# EAGLE design XBee SX THT Adapter (EAGLE 7.5.0)
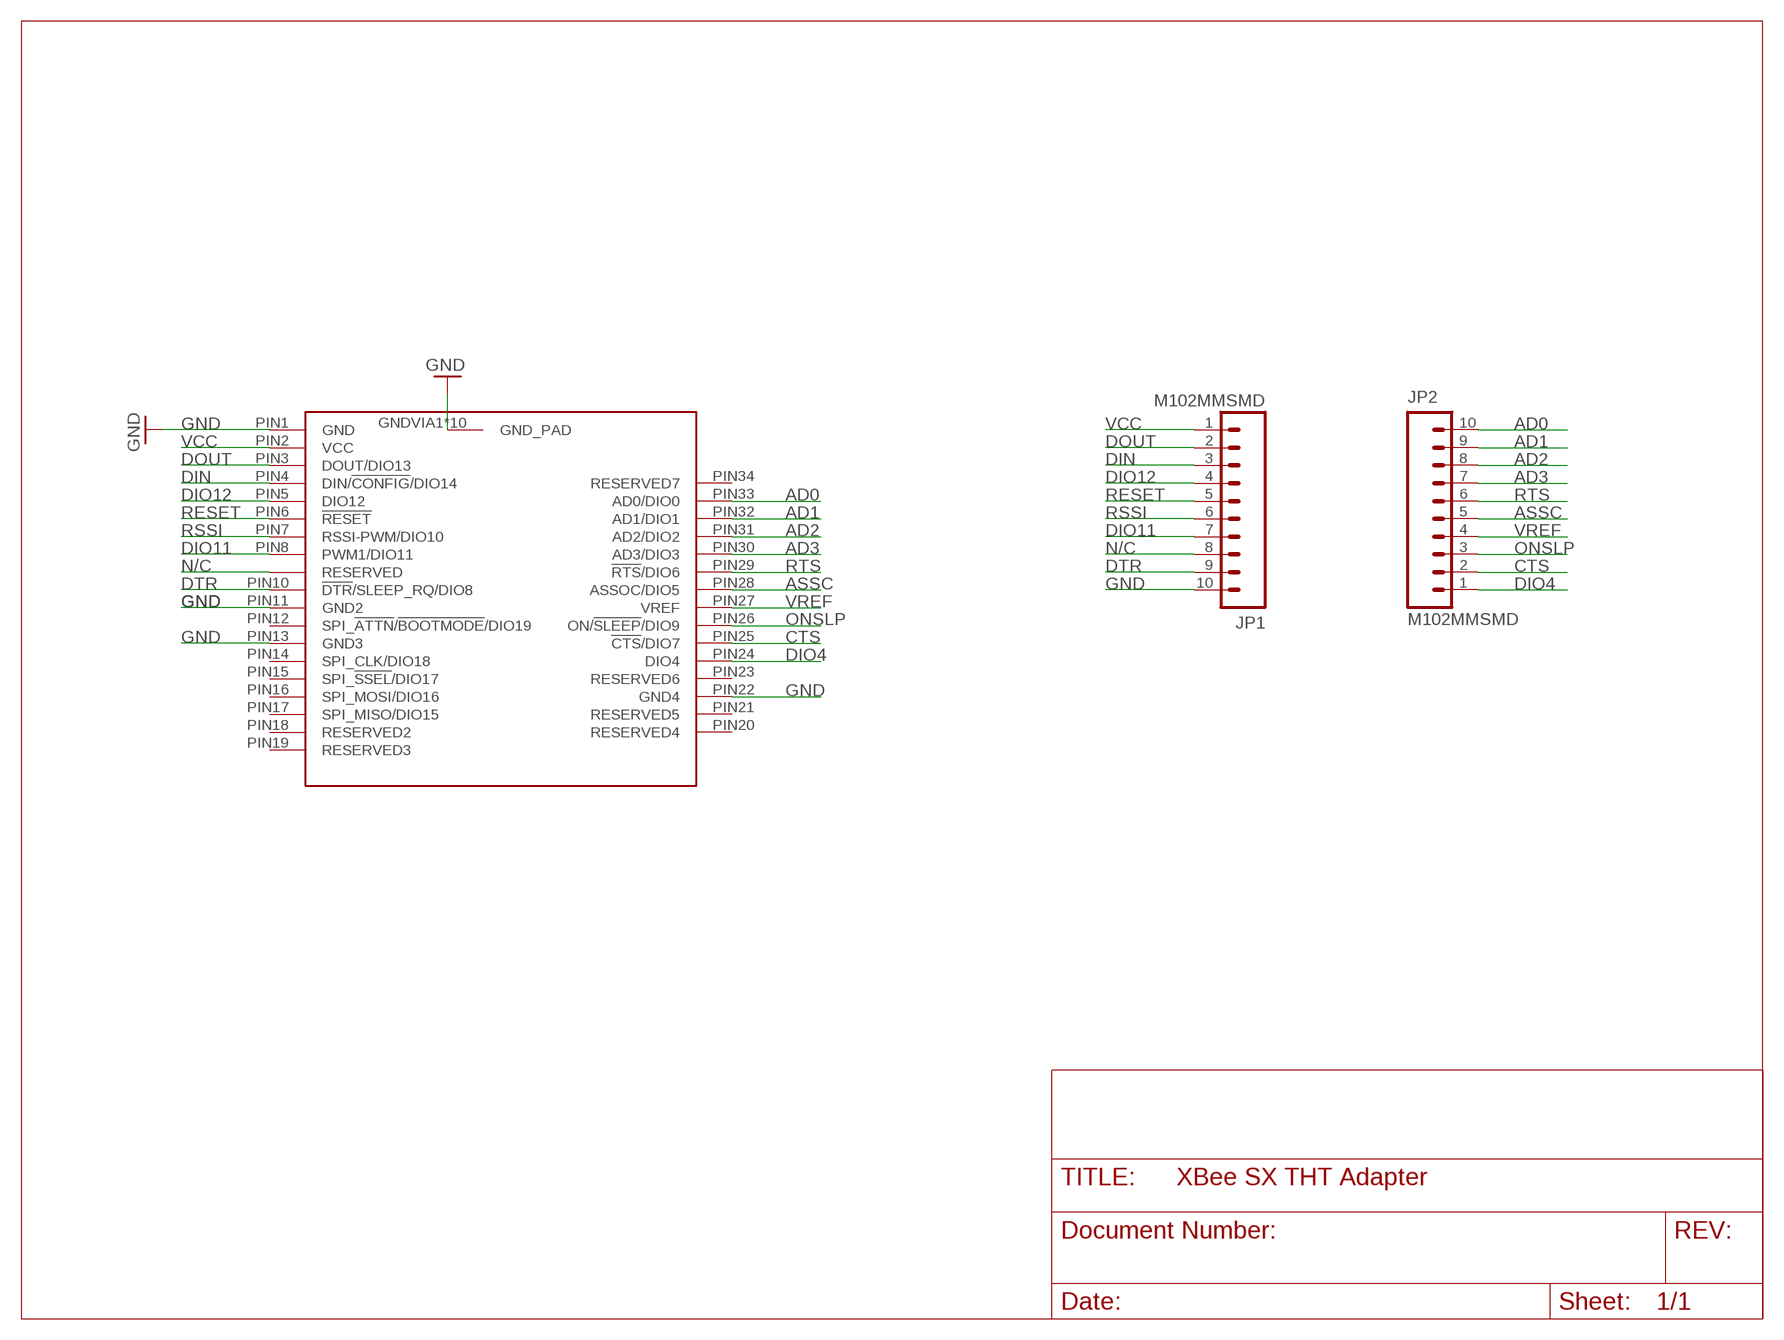
[diagram p0: schematic, sheet 1]

## Parts
JP1  M102MMSMD  [1X10-2MM-SMD]
JP2  M102MMSMD  [1X10-2MM-SMD]
U$2  XBEE-SMT  QUBIQ_XBEE-SMT-SX  [QUBIQ_FLAT-RF-SX]

## Nets
AD0: JP2.10 U$2.PIN33(AD0/DIO0)
AD1: JP2.9 U$2.PIN32(AD1/DIO1)
AD2: JP2.8 U$2.PIN31(AD2/DIO2)
AD3: JP2.7 U$2.PIN30(AD3/DIO3)
ASSC: JP2.5 U$2.PIN28(ASSOC/DIO5)
CTS: JP2.2 U$2.PIN25(!CTS!/DIO7)
DIN: JP1.3 U$2.PIN4(DIN/!CONFIG!/DIO14)
DIO4: JP2.1 U$2.PIN24(DIO4)
DIO11: JP1.7 U$2.PIN8(PWM1/DIO11)
DIO12: JP1.4 U$2.PIN5(DIO12)
DOUT: JP1.2 U$2.PIN3(DOUT/DIO13)
DTR: JP1.9 U$2.PIN10(!DTR!/SLEEP_RQ/DIO8)
GND: JP1.10 U$2.GND_PAD U$2.GNDVIA1(GND_PAD) U$2.GNDVIA2(GND_PAD) U$2.GNDVIA3(GND_PAD) U$2.GNDVIA4(GND_PAD) U$2.GNDVIA5(GND_PAD) U$2.GNDVIA6(GND_PAD) U$2.GNDVIA7(GND_PAD) U$2.GNDVIA8(GND_PAD) U$2.GNDVIA9(GND_PAD) U$2.PIN1(GND) U$2.PIN11(GND2) U$2.PIN13(GND3) U$2.PIN22(GND4)
N/C: JP1.8 U$2.PIN9(RESERVED)
ONSLP: JP2.3 U$2.PIN26(ON/!SLEEP!/DIO9)
RESET: JP1.5 U$2.PIN6(!RESET)
RSSI: JP1.6 U$2.PIN7(RSSI-PWM/DIO10)
RTS: JP2.6 U$2.PIN29(!RTS!/DIO6)
VCC: JP1.1 U$2.PIN2(VCC)
VREF: JP2.4 U$2.PIN27(VREF)
Unconnected: U$2.PIN12(SPI_!ATTN!/!BOOTMODE!/DIO19) U$2.PIN14(SPI_CLK/DIO18) U$2.PIN15(SPI_!SSEL!/DIO17) U$2.PIN16(SPI_MOSI/DIO16) U$2.PIN17(SPI_MISO/DIO15) U$2.PIN18(RESERVED2) U$2.PIN19(RESERVED3) U$2.PIN20(RESERVED4) U$2.PIN21(RESERVED5) U$2.PIN23(RESERVED6) U$2.PIN34(RESERVED7)

## Library data of the parts
JP1 JP2 = SparkFun-Connectors:M10: Header 10 Standard 10-pin 0.1" header. Use with straight break away headers (SKU : PRT-00116), right angle break away headers (PRT-00553), swiss pins (PRT-00743), machine pins (PRT-00117), and female headers (PRT-00115).
U$2 = xbee-smt:QUBIQ_XBEE-SMT-SX

## Board
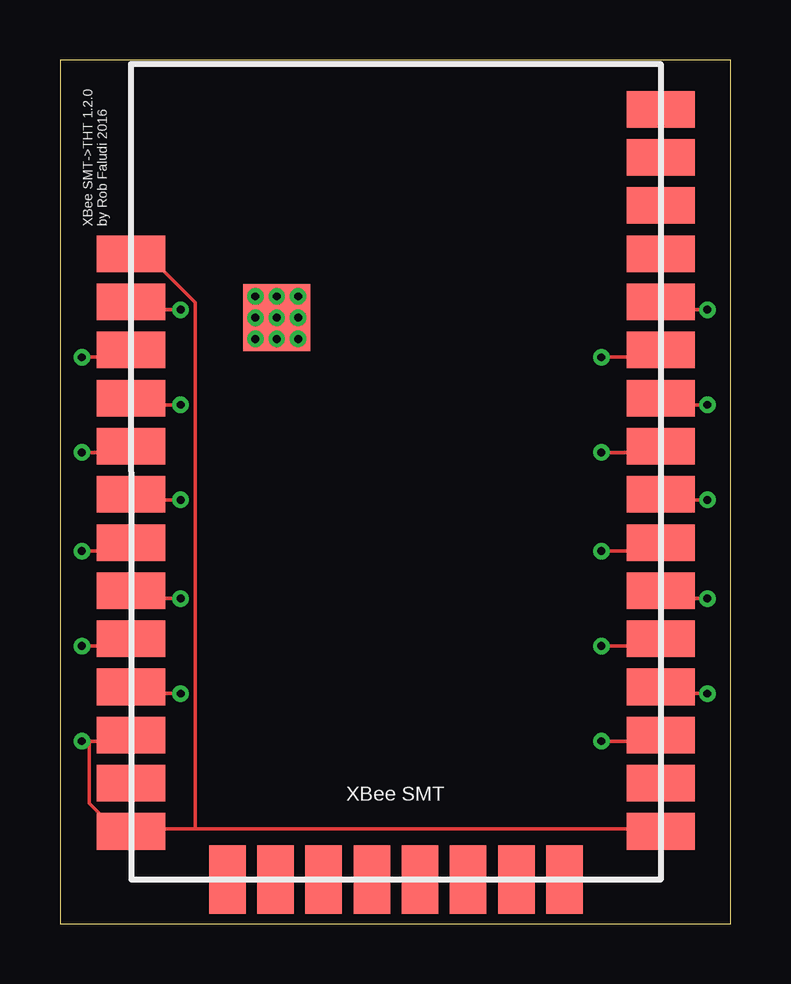
[diagram p1: board, top side]
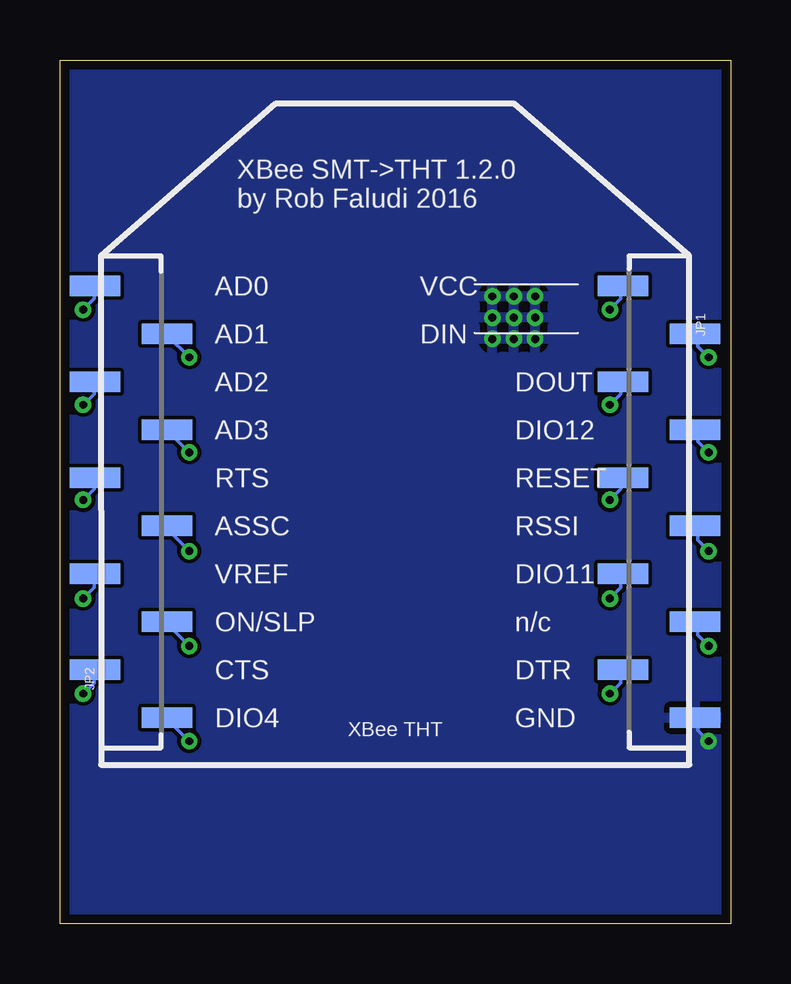
[diagram p2: board, bottom side, seen from below]

Size 27.94 x 36.02 mm. Coordinates in mm from the lower left corner, seen from the top.
Outline: 0,0 27.94,0 27.94,36.02 0,36.02 0,0
Copper layers (1*16): Top 0.0356mm / dielectric 1.5011mm / Bottom 0.0356mm
Design rules "oshpark-2layer": minimum track width 6mil, minimum drill 13mil, track to track 6mil, track to pad 6mil, pad to pad 6mil, via to via 6mil, smd to smd 6mil, copper to edge 15mil, drill to drill 6mil, minimum pad ring 7mil, minimum via ring 7mil, stop-mask expansion 2.5mil, vias tented up to drill 0mil, thermal gap 10mil

### Footprints (pad centres in the part's own frame; a part is rotated, then mirrored left to right if it is on the bottom)
1X10-2MM-SMD = smd 0.85 x 2.1: 1 0,-1.5; 2 2,1.5; 3 4,-1.5; 4 6,1.5; 5 8,-1.5; 6 10,1.5; 7 12,-1.5; 8 14,1.5; 9 16,-1.5; 10 18,1.5
QUBIQ_FLAT-RF-SX = smd 2.794 x 2.794: GND_PAD -16.002,7.366 | drill 0.33: GNDVIA1 -16.891,8.255; GNDVIA2 -16.002,8.255; GNDVIA3 -15.113,8.255; GNDVIA4 -16.891,7.366; GNDVIA5 -16.002,7.366; GNDVIA6 -15.113,7.366; GNDVIA7 -16.891,6.477; GNDVIA8 -16.002,6.477; GNDVIA9 -15.113,6.477 | smd 2.845 x 1.524: PIN1 -22.073,10.033; PIN2 -22.073,8.026; PIN3 -22.073,6.02; PIN4 -22.073,4.013; PIN5 -22.073,2.007; PIN6 -22.073,0; PIN7 -22.073,-2.007; PIN8 -22.073,-4.013; PIN9 -22.073,-6.02; PIN10 -22.073,-8.026; PIN11 -22.073,-10.033; PIN12 -22.073,-12.04; PIN13 -22.073,-14.046; PIN22 0,-14.046; PIN23 0,-12.04; PIN24 0,-10.033; PIN25 0,-8.026; PIN26 0,-6.02; PIN27 0,-4.013; PIN28 0,-2.007; PIN29 0,0; PIN30 0,2.007; PIN31 0,4.013; PIN32 0,6.02; PIN33 0,8.026; PIN34 0,10.033; PIN35 0,12.04; PIN36 0,14.046; PIN37 0,16.053 | smd 1.524 x 2.845: PIN14 -18.059,-16.053; PIN15 -16.053,-16.053; PIN16 -14.046,-16.053; PIN17 -12.04,-16.053; PIN18 -10.033,-16.053; PIN19 -8.026,-16.053; PIN20 -6.02,-16.053; PIN21 -4.013,-16.053

### Placement (x,y rotation side)
JP1  2.97,26.6 270 bottom
JP2  24.97,8.6 90 bottom
U$2  25.03,17.91 0 top

### Tracks (layer width: path | path; a pad name or v marks a point on that pad's centre or on a via)
AD0  (via drill 0.33)
  Top 0.152: v26.98,25.6 25.45,25.6 25.15,25.91 U$2.PIN33
  Bottom 0.152: v26.98,25.6 26.52,26.06 26.52,26.52 JP2.10
AD1  (via drill 0.33)
  Top 0.152: v22.55,23.62 24.69,23.62 24.99,23.93 U$2.PIN32
  Bottom 0.152: v22.55,23.62 23.47,24.54 JP2.9
AD2  (via drill 0.33)
  Top 0.152: v26.98,21.64 25.3,21.64 25.15,21.79 U$2.PIN31
  Bottom 0.152: v26.98,21.64 26.52,22.1 26.52,22.55 JP2.8
AD3  (via drill 0.33)
  Top 0.152: v22.55,19.66 24.84,19.66 24.99,19.81 U$2.PIN30
  Bottom 0.152: v22.55,19.66 23.47,20.57 JP2.7
ASSC  (via drill 0.33)
  Top 0.152: v22.55,15.54 24.69,15.54 24.99,15.85 U$2.PIN28
  Bottom 0.152: v22.55,15.54 23.47,16.46 JP2.5
CTS  (via drill 0.33)
  Top 0.152: v26.98,9.6 25.3,9.6 25.15,9.75 U$2.PIN25
  Bottom 0.152: v26.98,9.6 26.52,10.06 26.52,10.52 JP2.2
DIN  (via drill 0.33)
  Top 0.152: v5.03,21.64 3.2,21.64 3.05,21.79 U$2.PIN4
  Bottom 0.152: v5.03,21.64 4.57,22.1 4.57,22.55 JP1.3
DIO4  (via drill 0.33)
  Top 0.152: v22.55,7.62 24.84,7.62 24.99,7.77 U$2.PIN24
  Bottom 0.152: v22.55,7.62 23.47,8.53 JP2.1
DIO11  (via drill 0.33)
  Top 0.152: v5.03,13.56 3.35,13.56 3.05,13.87 U$2.PIN8
  Bottom 0.152: v5.03,13.56 4.57,14.02 4.57,14.48 JP1.7
DIO12  (via drill 0.33)
  Top 0.152: v0.91,19.66 2.74,19.66 2.9,19.81 U$2.PIN5
  Bottom 0.152: v0.91,19.66 1.37,20.12 1.37,20.57 JP1.4
DOUT  (via drill 0.33)
  Top 0.152: v0.91,23.62 2.59,23.62 2.9,23.93 U$2.PIN3
  Bottom 0.152: v0.91,23.62 1.37,24.08 1.37,24.54 JP1.2
DTR  (via drill 0.33)
  Top 0.152: v5.03,9.6 3.2,9.6 3.05,9.75 U$2.PIN10
  Bottom 0.152: v5.03,9.6 4.57,10.06 4.57,10.52 JP1.9
GND  (via drill 0.33)
  Top 0.152: 1.22,7.62 2.74,7.62 2.9,7.77 U$2.PIN11 | 1.22,7.62 1.22,5.03 2.29,3.96 2.9,3.96 U$2.PIN13 3.05,3.96 5.64,3.96 | 1.22,7.62 v0.91,7.62 | 5.64,3.96 24.99,3.96 U$2.PIN22 | 5.64,3.96 5.64,25.91 3.66,27.89 3.05,27.89 U$2.PIN1
  Bottom 0.152: v0.91,7.62 1.37,8.08 1.37,8.53 JP1.10
  pour Bottom: 0.3,35.7 27.6,35.7 27.6,0.3 0.3,0.3
N/C  (via drill 0.33)
  Top 0.152: v0.91,11.58 2.59,11.58 2.9,11.89 U$2.PIN9
  Bottom 0.152: v0.91,11.58 1.37,12.04 1.37,12.5 JP1.8
ONSLP  (via drill 0.33)
  Top 0.152: v22.55,11.58 24.69,11.58 24.99,11.89 U$2.PIN26
  Bottom 0.152: v22.55,11.58 23.47,12.5 JP2.3
RESET  (via drill 0.33)
  Top 0.152: v5.03,17.68 3.2,17.68 3.05,17.83 U$2.PIN6
  Bottom 0.152: v5.03,17.68 4.57,18.14 4.57,18.59 JP1.5
RSSI  (via drill 0.33)
  Top 0.152: v0.91,15.54 2.59,15.54 2.9,15.85 U$2.PIN7
  Bottom 0.152: v0.91,15.54 1.37,16 1.37,16.46 JP1.6
RTS  (via drill 0.33)
  Top 0.152: v26.98,17.68 25.3,17.68 25.15,17.83 U$2.PIN29
  Bottom 0.152: v26.98,17.68 26.52,18.14 26.52,18.59 JP2.6
VCC  (via drill 0.33)
  Top 0.152: v5.03,25.6 3.35,25.6 3.05,25.91 U$2.PIN2
  Bottom 0.152: v5.03,25.6 4.57,26.06 4.57,26.52 JP1.1
VREF  (via drill 0.33)
  Top 0.152: v26.98,13.56 25.45,13.56 25.15,13.87 U$2.PIN27
  Bottom 0.152: v26.98,13.56 26.52,14.02 26.52,14.48 JP2.4

### Text on the board
tNames: XBee SMT->THT 1.2.0 / by Rob Faludi 2016 | XBee SMT
bNames: XBee SMT->THT 1.2.0 / by Rob Faludi 2016 | VCC | AD0 | DIN | AD1 | DOUT | AD2 | DIO12 | AD3 | RESET | RTS | RSSI | ASSC | DIO11 | VREF | n/c | ON/SLP | DTR | CTS | GND | XBee THT | DIO4